# EAGLE design RGBdriverModuleAutoCurrent (EAGLE 5.07)
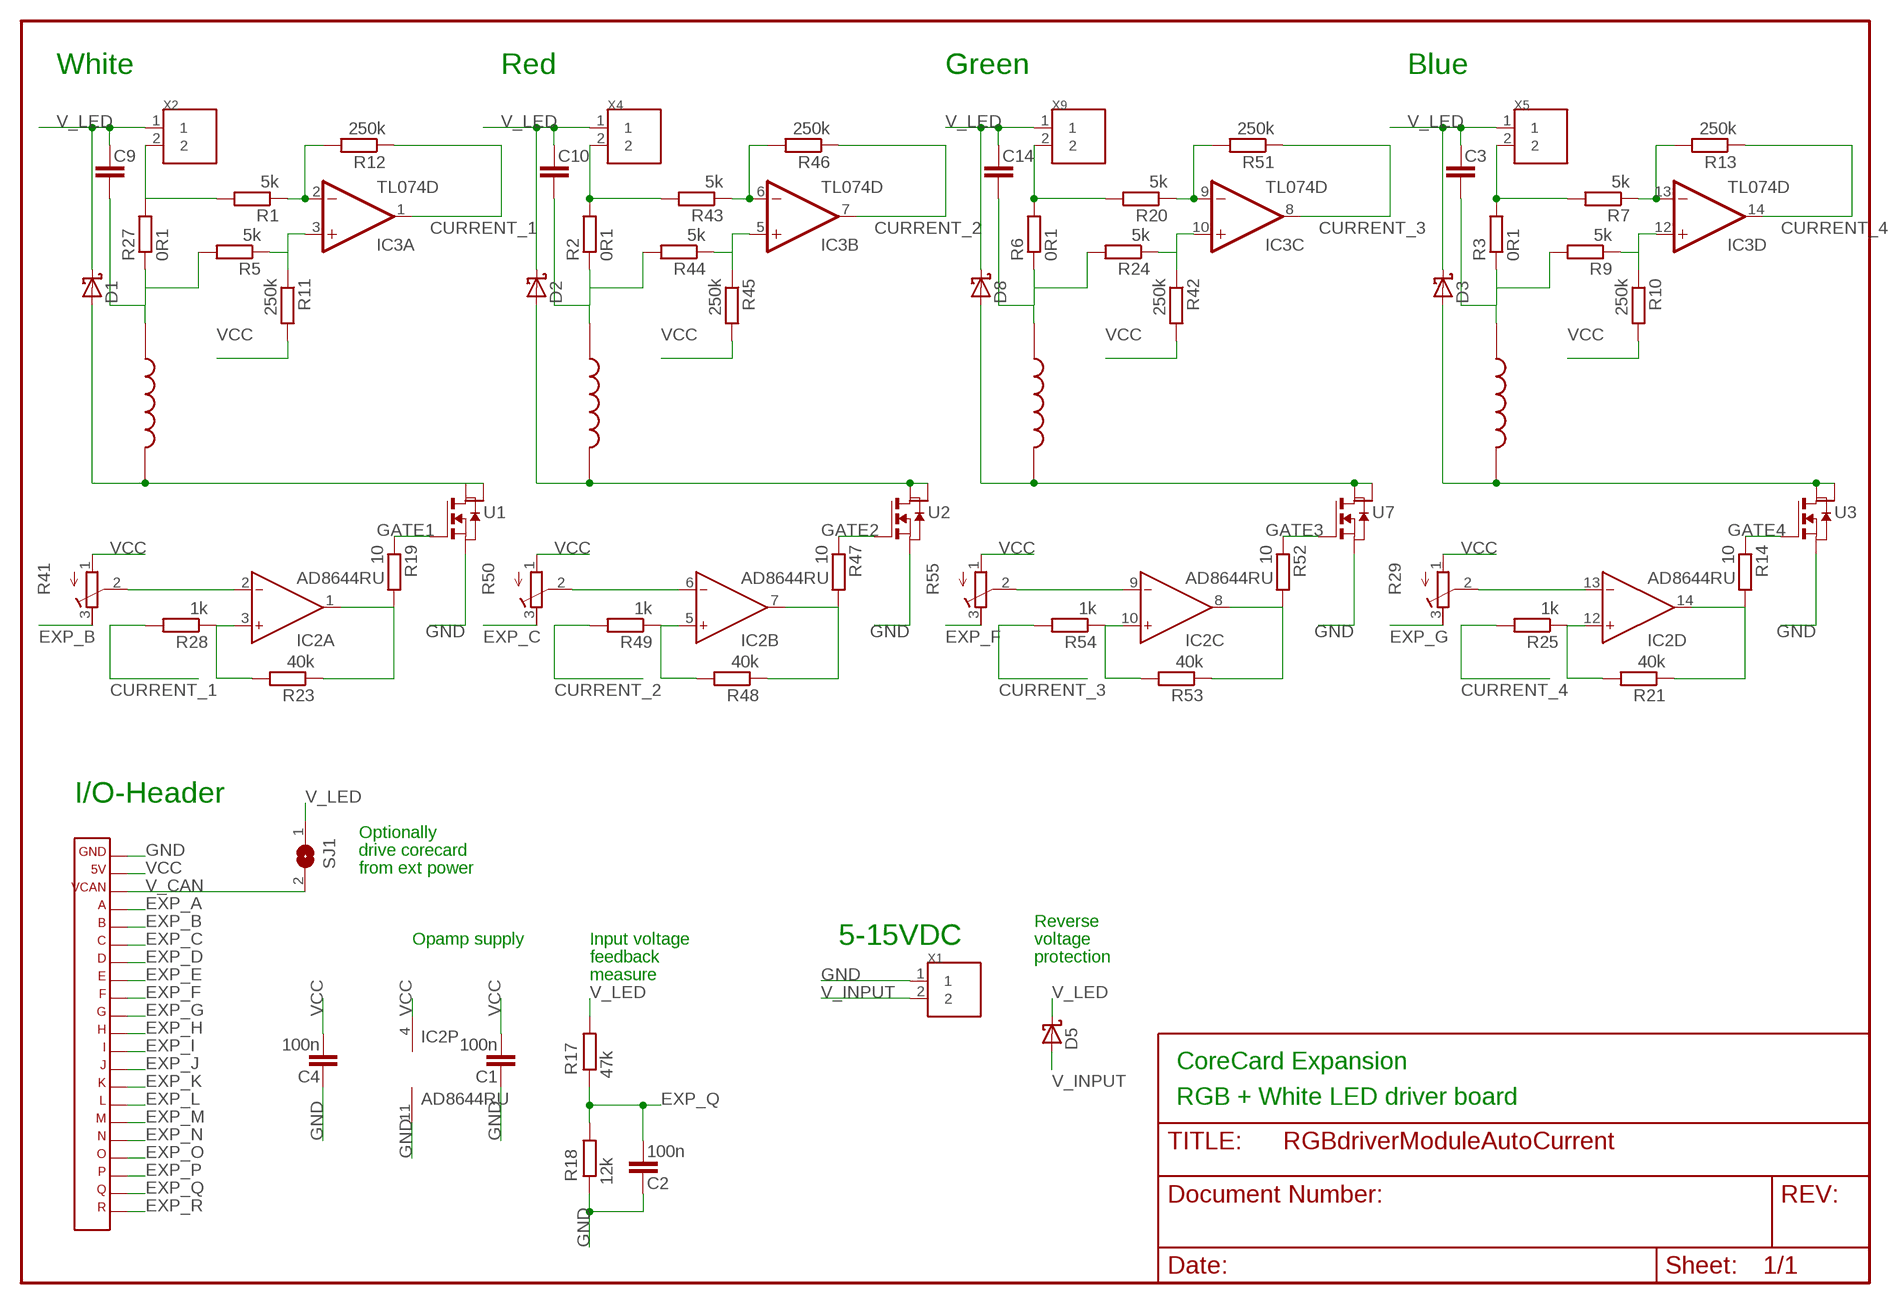
[diagram p0: schematic, sheet 1]

## Parts
C1  100n  C-EUC0603  [C0603]
C2  100n  C-EUC0603  [C0603]
C3  C-EUC1210  [C1210]
C4  100n  C-EUC0603  [C0603]
C9  C-EUC1210  [C1210]
C10  C-EUC1210  [C1210]
C14  C-EUC1210  [C1210]
D1  SCHOTTKY-DIODESMC  [SMC]
D2  SCHOTTKY-DIODESMC  [SMC]
D3  SCHOTTKY-DIODESMC  [SMC]
D5  SCHOTTKY-DIODESMC  [SMC]
D8  SCHOTTKY-DIODESMC  [SMC]
IC2  AD8644RU  [TSSOP14]
IC3  TL074D  [SO14]
L1  10X10  [10X10]
L"  10X10  [10X10]
L"1  10X10  [10X10]
L"2  10X10  [10X10]
R1  5k  R-EUR0603  [R0603]
R2  0R1  R-EUR1206  [R1206]
R3  0R1  R-EUR1206  [R1206]
R5  5k  R-EUR0603  [R0603]
R6  0R1  R-EUR1206  [R1206]
R7  5k  R-EUR0603  [R0603]
R9  5k  R-EUR0603  [R0603]
R10  250k  R-EUR0603  [R0603]
R11  250k  R-EUR0603  [R0603]
R12  250k  R-EUR0603  [R0603]
R13  250k  R-EUR0603  [R0603]
R14  10  R-EUR0603  [R0603]
R17  47k  R-EUR0603  [R0603]
R18  12k  R-EUR0603  [R0603]
R19  10  R-EUR0603  [R0603]
R20  5k  R-EUR0603  [R0603]
R21  40k  R-EUR0603  [R0603]
R23  40k  R-EUR0603  [R0603]
R24  5k  R-EUR0603  [R0603]
R25  1k  R-EUR0603  [R0603]
R27  0R1  R-EUR1206  [R1206]
R28  1k  R-EUR0603  [R0603]
R29  R-TRIM  [TRIM_PVZ3]
R41  R-TRIM  [TRIM_PVZ3]
R42  250k  R-EUR0603  [R0603]
R43  5k  R-EUR0603  [R0603]
R44  5k  R-EUR0603  [R0603]
R45  250k  R-EUR0603  [R0603]
R46  250k  R-EUR0603  [R0603]
R47  10  R-EUR0603  [R0603]
R48  40k  R-EUR0603  [R0603]
R49  1k  R-EUR0603  [R0603]
R50  R-TRIM  [TRIM_PVZ3]
R51  250k  R-EUR0603  [R0603]
R52  10  R-EUR0603  [R0603]
R53  40k  R-EUR0603  [R0603]
R54  1k  R-EUR0603  [R0603]
R55  R-TRIM  [TRIM_PVZ3]
SJ1  SJ_NO  [SJ_NO]
U1  NFT3055L175  [SOT223]
U2  NFT3055L175  [SOT223]
U3  NFT3055L175  [SOT223]
U7  NFT3055L175  [SOT223]
X1  BLOCK2  [PCB2]
X2  BLOCK2  [PCB2]
X3  CORE_IOHEADEXP  [CORE_IOHEAD_NOSILC]
X4  BLOCK2  [PCB2]
X5  BLOCK2  [PCB2]
X9  BLOCK2  [PCB2]

## Nets
CURRENT_1: IC3.1(A:OUT) R12.1 R28.2
CURRENT_2: IC3.7(B:OUT) R46.1 R49.2
CURRENT_3: IC3.8(C:OUT) R51.1 R54.2
CURRENT_4: IC3.14(D:OUT) R13.1 R25.2
EXP_A: X3.4
EXP_B: R41.3(PAD3) X3.5
EXP_C: R50.3(PAD3) X3.6
EXP_D: X3.7
EXP_E: X3.8
EXP_F: R55.3(PAD3) X3.9
EXP_G: R29.3(PAD3) X3.10
EXP_H: X3.11
EXP_I: X3.12
EXP_J: X3.13
EXP_K: X3.14
EXP_L: X3.15
EXP_M: X3.16
EXP_N: X3.17
EXP_O: X3.18
EXP_P: X3.19
EXP_Q: C2.2 R17.1 R18.2 X3.20
EXP_R: X3.21
GATE1: R19.1 U1.1(G)
GATE2: R47.1 U2.1(G)
GATE3: R52.1 U7.1(G)
GATE4: R14.1 U3.1(G)
GND: C1.1 C2.1 C4.1 IC2.11(P:V-) R18.1 U1.3(S) U2.3(S) U3.3(S) U7.3(S) X1.1 X3.1
L1: D1.A L1.P$2 U1.2(D) U1.4(D_PAD)
L2: D8.A L"2.P$2 U7.2(D) U7.4(D_PAD)
L3: D3.A L"1.P$2 U3.2(D) U3.4(D_PAD)
L8: D2.A L".P$2 U2.2(D) U2.4(D_PAD)
N$1: IC2.3(A:IN+) R23.2 R28.1
N$2: C14.2 L"2.P$1 R6.1 R24.2
N$4: R6.2 R20.2 X9.2
N$5: C9.2 L1.P$1 R5.2 R27.1
N$7: C3.2 L"1.P$1 R3.1 R9.2
N$8: R3.2 R7.2 X5.2
N$12: R1.2 R27.2 X2.2
N$13: IC3.13(D:-IN) R7.1 R13.2
N$14: IC2.14(D:OUT) R14.2 R21.1
N$15: IC2.12(D:IN+) R21.2 R25.1
N$16: IC2.1(A:OUT) R19.2 R23.1
N$17: IC2.13(D:IN-) R29.2(PAD2)
N$19: IC3.3(A:+IN) R5.1 R11.1
N$21: IC3.2(A:-IN) R1.1 R12.2
N$22: IC3.12(D:+IN) R9.1 R10.1
N$30: IC2.2(A:IN-) R41.2(PAD2)
N$31: C10.2 L".P$1 R2.1 R44.2
N$32: R2.2 R43.2 X4.2
N$33: IC3.6(B:-IN) R43.1 R46.2
N$34: IC2.7(B:OUT) R47.2 R48.1
N$35: IC2.5(B:IN+) R48.2 R49.1
N$36: IC2.6(B:IN-) R50.2(PAD2)
N$37: IC3.5(B:+IN) R44.1 R45.1
N$38: IC3.9(C:-IN) R20.1 R51.2
N$39: IC2.8(C:OUT) R52.2 R53.1
N$40: IC2.10(C:IN+) R53.2 R54.1
N$41: IC2.9(C:IN-) R55.2(PAD2)
N$42: IC3.10(C:+IN) R24.1 R42.1
V_CAN: SJ1.2 X3.3
V_INPUT: D5.A X1.2
V_LED: C3.1 C9.1 C10.1 C14.1 D1.C D2.C D3.C D5.C D8.C R17.2 SJ1.1 X2.1 X4.1 X5.1 X9.1
VCC: C1.2 C4.2 IC2.4(P:V+) R10.2 R11.2 R29.1(PAD1) R41.1(PAD1) R42.2 R45.2 R50.1(PAD1) R55.1(PAD1) X3.2

## Notes on the sheet
- White | Red | Green | Blue
- I/O-Header
- Optionally
- drive corecard
- from ext power
- Reverse
- Opamp supply | Input voltage | 5-15VDC | voltage
- feedback | protection
- measure
- CoreCard Expansion
- RGB + White LED driver board

## Power pins joined to a net without a drawn wire
V+: IC3.4(P:V+)
V-: IC3.11(P:V-)

## Library data of the parts
C1-C4 C9 C10 C14 = rcl:C-EU
D1-D3 D5 D8 = diode:SCHOTTKY-DIODE
IC2 = analog-devices:AD8644: Single and Quad 18 V Operational Amplifiers Source: http://www.analog.com/static/imported-files/data_sheets/AD8614_8644.pdf
IC3 = linear:TL074: OP AMP
L1 L" L"1 L"2 = inductor10x10:10X10
R1-R3 R5-R7 R9-R14 R17-R21 R23-R25 R27 R28 R42-R49 R51-R54 = rcl:R-EU
R29 R41 R50 R55 = rcl:R-TRIM
SJ1 = jumper:SJ_NO
U1-U3 U7 = NMOS_NTF3055L175:NFT3055L175
X1 X2 X4 X5 X9 = terminal_block:BLOCK2
X3 = expboard:CORE_IOHEAD: CoreCard IO-header for expansion cards

## Board
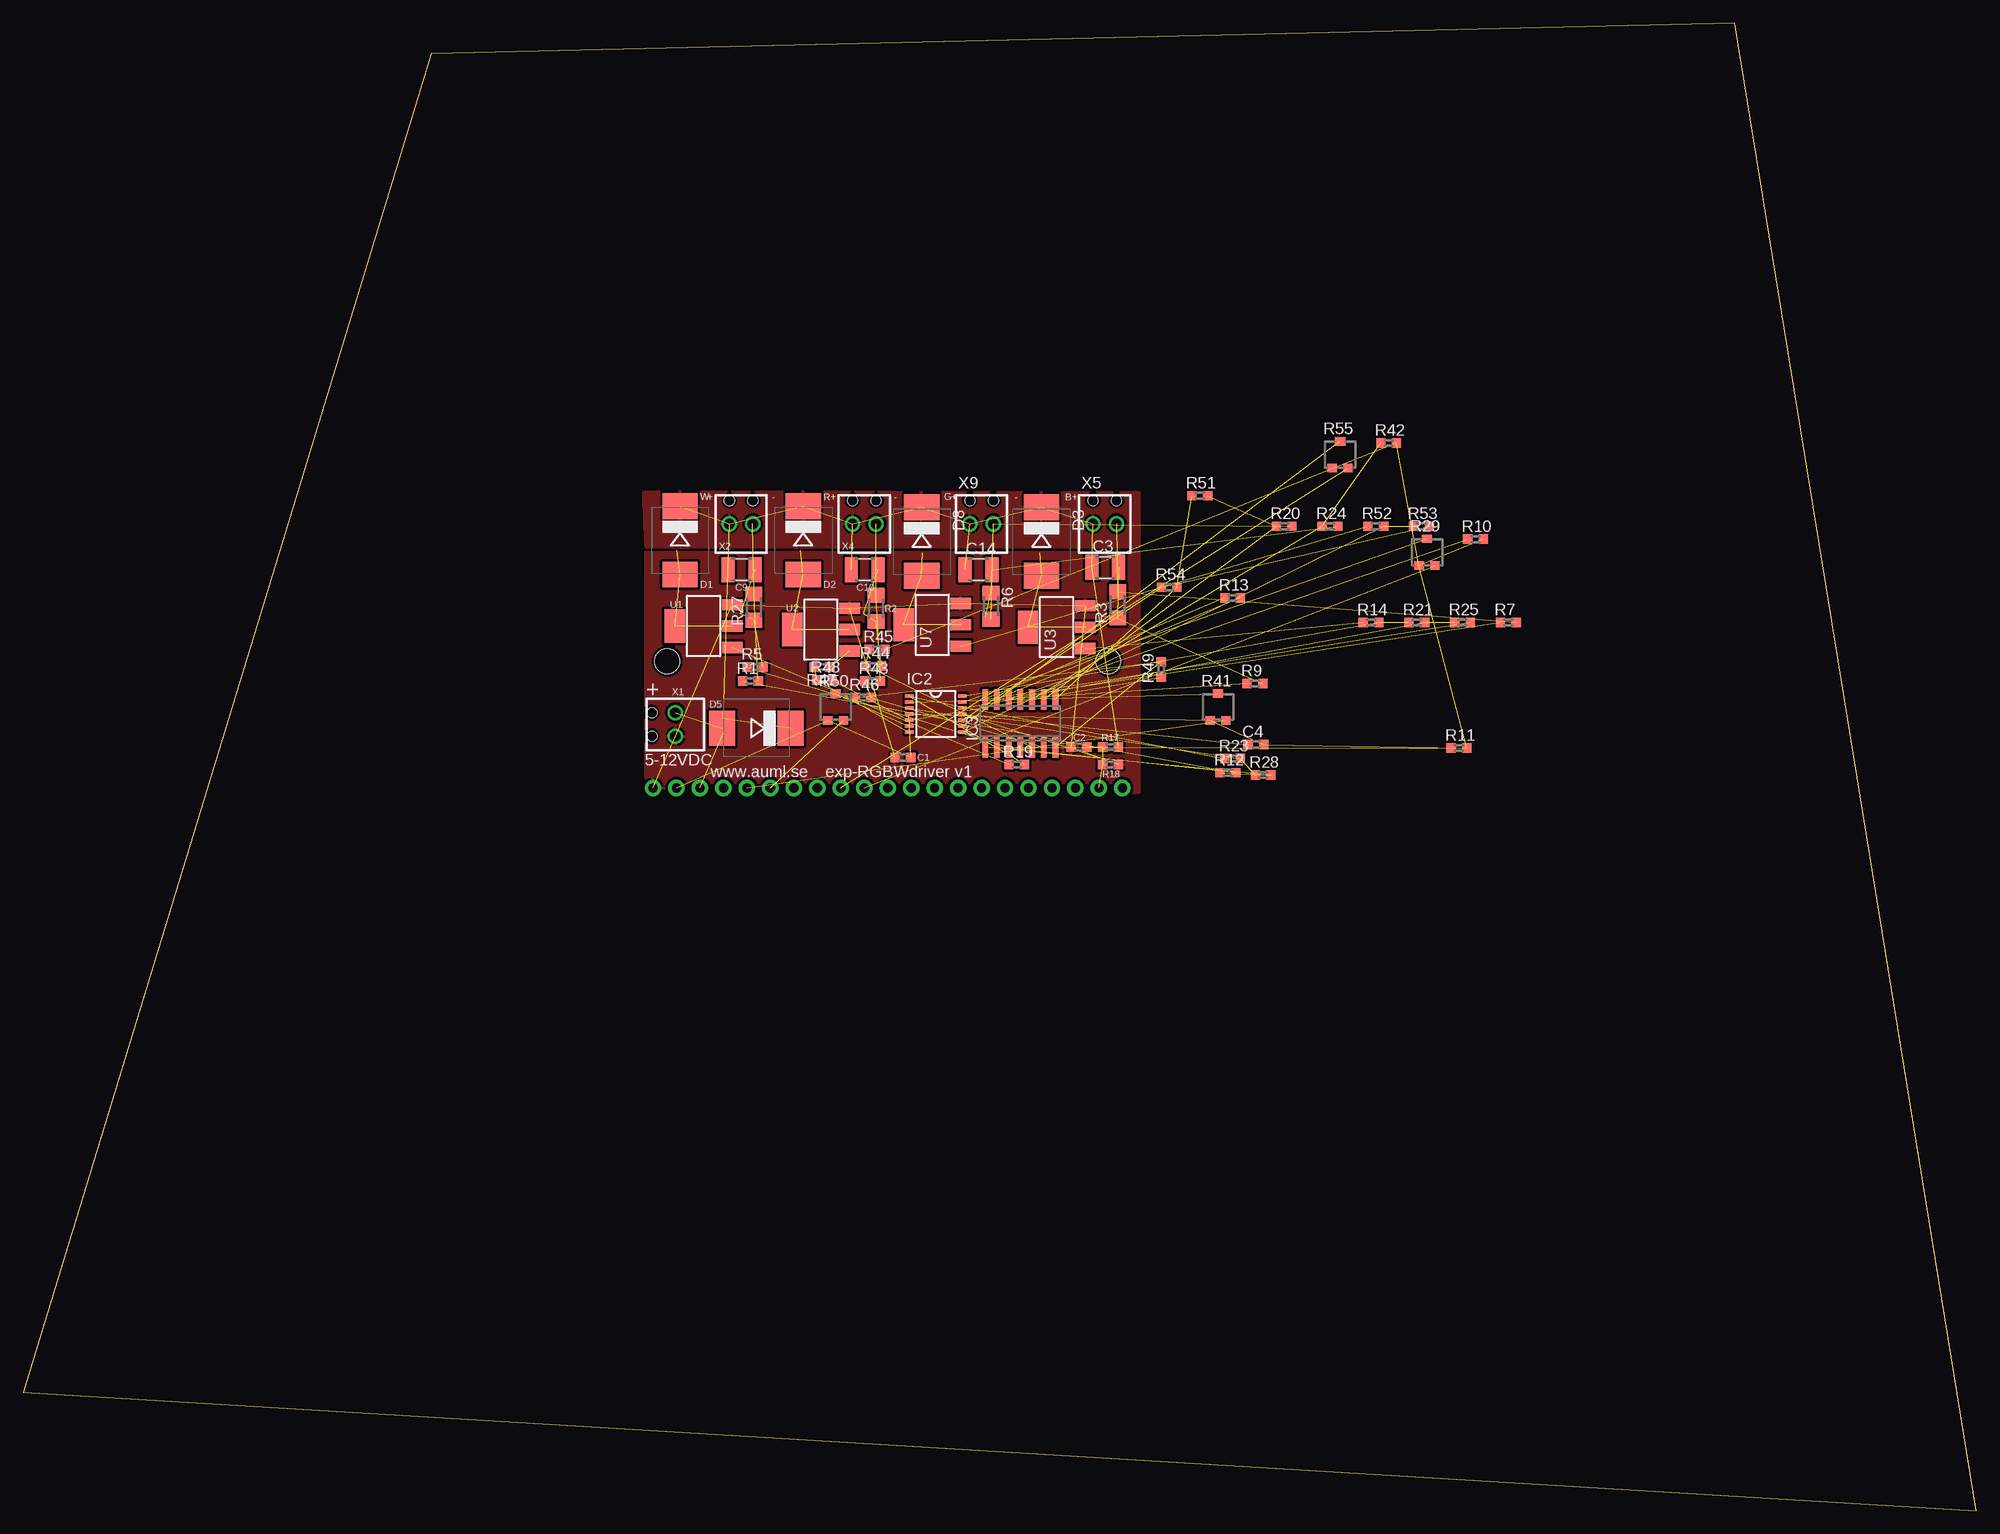
[diagram p1: board, top side]
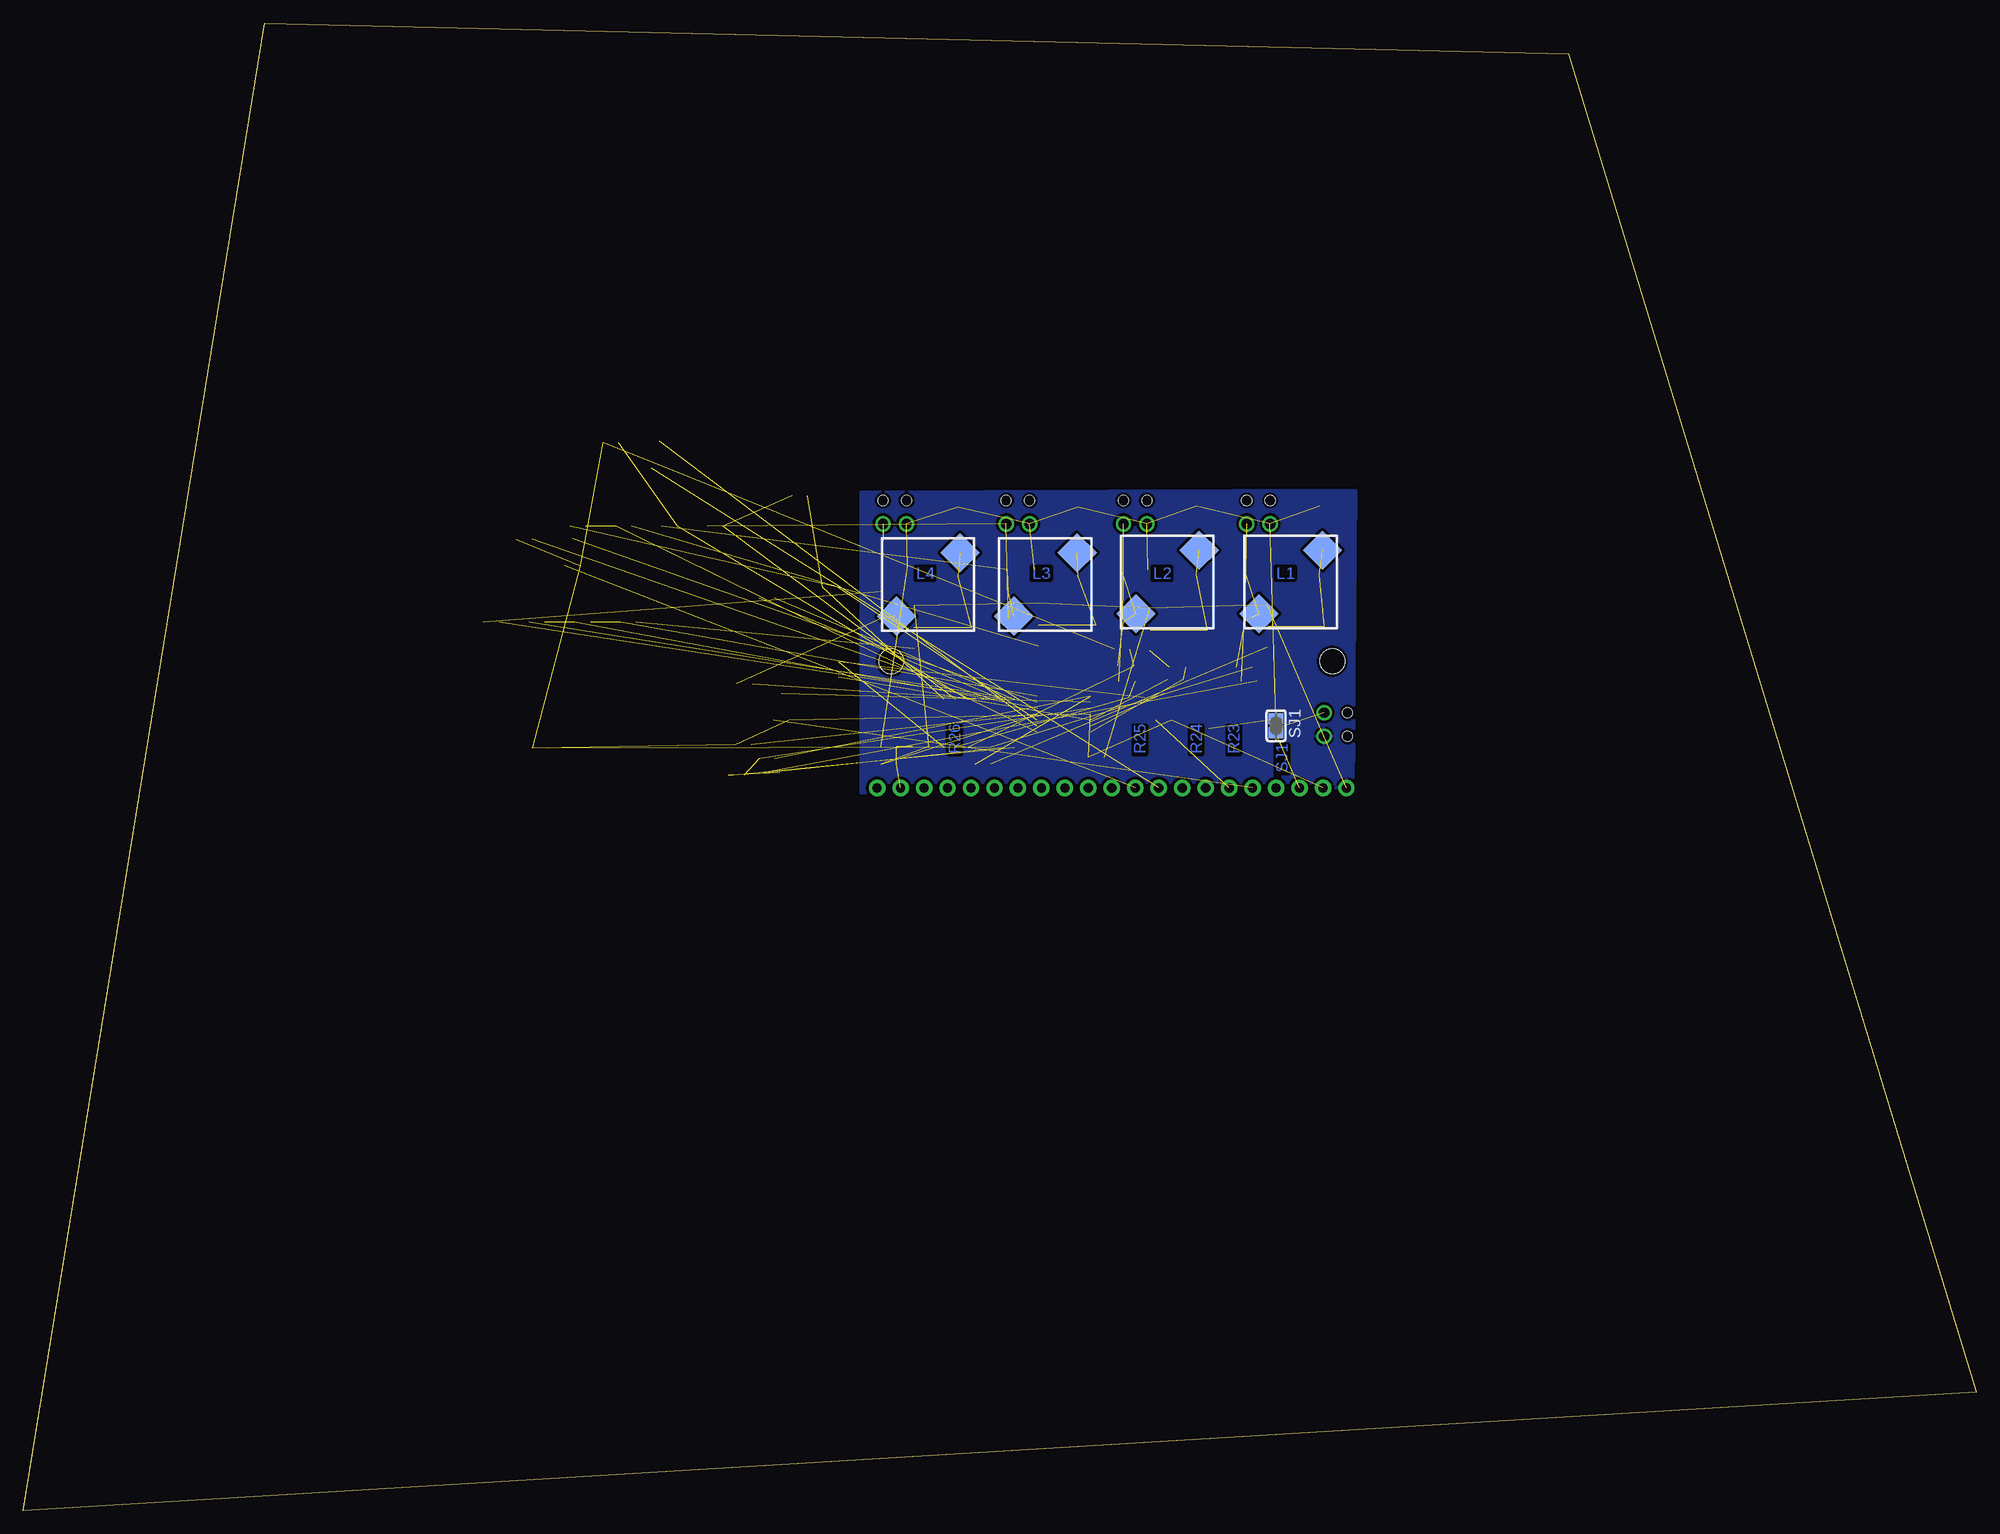
[diagram p2: board, bottom side, seen from below]

Size 211.46 x 161.01 mm. Coordinates in mm from the lower left corner, seen from the top.
Outline: 0,12.83 211.46,0 185.29,161.01 44.2,157.71 0,12.83
Copper layers (1*16): Top 0.035mm / dielectric 1.5mm / Bottom 0.035mm
Design rules "default": minimum track width 10mil, minimum drill 0.4mm, track to track 10mil, track to pad 10mil, pad to pad 10mil, via to via 10mil, smd to smd 8mil, copper to edge 10mil, drill to drill 8mil, minimum pad ring 10mil, minimum via ring 10mil, stop-mask expansion 4mil, vias tented up to drill 18mil, thermal gap 10mil
Holes 2.7 mm at 69.72,91.95 117.47,91.95

### Footprints (pad centres in the part's own frame; a part is rotated, then mirrored left to right if it is on the bottom)
C0603 = smd 1 x 1: 1 -0.85,0; 2 0.85,0
C1210 = smd 1.4 x 2.7: 1 -1.4,0; 2 1.5,0
SMC = smd 2.8 x 3.8: A 3.7,0; C -3.7,0
TSSOP14 = smd 0.9 x 0.35: 1 -2.875,1.95; 2 -2.875,1.3; 3 -2.875,0.65; 4 -2.875,0; 5 -2.875,-0.65; 6 -2.875,-1.3; 7 -2.875,-1.95; 8 2.875,-1.95; 9 2.875,-1.3; 10 2.875,-0.65; 11 2.875,0; 12 2.875,0.65; 13 2.875,1.3; 14 2.875,1.95
SO14 = smd 0.6 x 2.2: 1 -3.81,-2.6; 2 -2.54,-2.6; 3 -1.27,-2.6; 4 0,-2.6; 5 1.27,-2.6; 6 2.54,-2.6; 7 3.81,-2.6; 8 3.81,2.6; 9 2.54,2.6; 10 1.27,2.6; 11 0,2.6; 12 -1.27,2.6; 13 -2.54,2.6; 14 -3.81,2.6
10X10 = smd 3 x 3 rotated 45: P$1 1.588,1.588; P$2 8.447,8.447
R0603 = smd 0.991 x 1.016: 1 -0.85,0; 2 0.85,0
R1206 = smd 1.6 x 1.803: 1 -1.422,0; 2 1.422,0
TRIM_PVZ3 = smd 1 x 0.9: 1 0.5,0.45; 3 2.2,0.45 | smd 1.1 x 0.9: 2 1.35,3.35
SJ_NO = smd 1.168 x 1.6: 1 -0.762,0; 2 0.762,0
SOT223 = smd 1.219 x 2.235: 1 -2.311,-3.099; 2 0,-3.099; 3 2.311,-3.099 | smd 3.6 x 2.2: 4 0,3.099
PCB2 = drill 1.1 round: 1 -2.54,0; 2 0,0 | hole 1.1: -2.54,2.54; 0,2.54
CORE_IOHEAD_NOSILC = drill 1 pad 1.778 round: 1 25.4,0; 2 22.86,0; 3 20.32,0; 4 17.78,0; 5 15.24,0; 6 12.7,0; 7 10.16,0; 8 7.62,0; 9 5.08,0; 10 2.54,0; 11 0,0; 12 -2.54,0; 13 -5.08,0; 14 -7.62,0; 15 -10.16,0; 16 -12.7,0; 17 -15.24,0; 18 -17.78,0; 19 -20.32,0; 20 -22.86,0; 21 -25.4,0

### Placement (x,y rotation side)
C1  95.25,81.53 0 top
C2  114.3,82.68 0 top
C3  117.09,102.11 0 top
C4  133.48,82.93 0 top
C9  77.72,101.85 0 top
C10  91.06,101.85 0 top
C14  103.38,101.85 0 top
D1  71.12,105.03 270 top
D2  84.45,105.03 270 top
D3  110.24,104.9 270 top
D5  79.38,84.71 180 top
D8  97.28,104.9 270 top
IC2  98.81,86.23 0 top
IC3  107.95,85.22 0 top
L1  79.25,95.5 0 bottom
L"  92.58,95.5 0 bottom
L"1  118.49,95.25 0 bottom
L"2  105.79,95.25 0 bottom
R1  78.74,89.79 0 top
R2  92.33,97.66 90 top
R3  118.49,98.04 90 top
R5  79.25,91.31 0 top
R6  104.78,97.92 270 top
R7  160.78,96.14 0 top
R9  133.35,89.53 0 top
R10  157.23,105.16 0 top
R11  155.45,82.55 0 top
R12  130.43,79.88 0 top
R13  130.94,98.81 0 top
R14  145.92,96.14 0 top
R17  117.73,82.68 0 top
R18  117.73,80.77 180 top
R19  107.57,80.77 0 top
R20  136.53,106.55 0 top
R21  150.88,96.14 0 top
R23  130.94,81.41 0 top
R24  141.48,106.55 0 top
R25  155.83,96.14 0 top
R27  79.12,97.79 90 top
R28  134.24,79.63 0 top
R29  150.62,101.85 0 top
R41  128.02,85.09 0 top
R42  147.83,115.57 0 top
R43  91.95,89.79 0 top
R44  92.08,91.44 0 top
R45  92.46,93.22 0 top
R46  90.93,88.01 0 top
R47  86.49,91.31 180 top
R48  86.74,89.92 0 top
R49  123.19,91.06 90 top
R50  86.61,85.09 0 top
R51  127.38,109.86 0 top
R52  146.43,106.55 0 top
R53  151.38,106.55 0 top
R54  124.08,99.95 0 top
R55  141.22,112.4 0 top
SJ1  75.82,84.96 270 bottom
U1  73.66,95.76 90 top
U2  86.36,95.38 90 top
U3  111.89,95.63 90 top
U7  98.42,95.89 90 top
X1  70.61,86.36 90 top
X2  78.99,106.81 0 top
X3  93.6,78.23 0 bottom
X4  92.33,106.81 0 top
X5  118.36,106.81 0 top
X9  105.03,106.81 0 top

### Tracks (layer width: path | path; a pad name or v marks a point on that pad's centre or on a via)
CURRENT_1  (2 unrouted)
CURRENT_2  (2 unrouted)
CURRENT_3  (2 unrouted)
CURRENT_4  (2 unrouted)
EXP_B  (1 unrouted)
EXP_C  (1 unrouted)
EXP_F  (1 unrouted)
EXP_G  (1 unrouted)
EXP_Q  (3 unrouted)
GATE1  (1 unrouted)
GATE2  (1 unrouted)
GATE3  (1 unrouted)
GATE4  (1 unrouted)
GND  (10 unrouted)
  pour Bottom (isolate 0.305, rank 3): 67.18,110.46 120.78,110.21 120.78,77.72 67.44,77.72
  pour Top (isolate 0.305, rank 3): 67.44,103.86 120.78,103.99 120.78,77.72 67.44,77.72
L1  (3 unrouted)
L2  (3 unrouted)
L3  (3 unrouted)
L8  (3 unrouted)
N$1  (2 unrouted)
N$2  (3 unrouted)
N$4  (2 unrouted)
N$5  (3 unrouted)
N$7  (3 unrouted)
N$8  (2 unrouted)
N$12  (2 unrouted)
N$13  (2 unrouted)
N$14  (2 unrouted)
N$15  (2 unrouted)
N$16  (2 unrouted)
N$17  (1 unrouted)
N$19  (2 unrouted)
N$21  (2 unrouted)
N$22  (2 unrouted)
N$30  (1 unrouted)
N$31  (3 unrouted)
N$32  (2 unrouted)
N$33  (2 unrouted)
N$34  (2 unrouted)
N$35  (2 unrouted)
N$36  (1 unrouted)
N$37  (2 unrouted)
N$38  (2 unrouted)
N$39  (2 unrouted)
N$40  (2 unrouted)
N$41  (1 unrouted)
N$42  (2 unrouted)
V_CAN  (1 unrouted)
V_INPUT  (1 unrouted)
V_LED  (14 unrouted)
  pour Top (isolate 0.305): 67.18,110.34 120.78,110.21 120.78,104.29 67.44,104.29
VCC  (11 unrouted)

### Text on the board
Bottom: L1 | L2 | L3 | L4 | R23 | R24 | R25 | R26 | SJ1
tPlace: W | + | - | R | + | - | G | + | - | B | + | + | 5-12VDC | www.auml.se | exp-RGBWdriver v1
Document: Corecard edge | Top is component side | Expansion will be mounted bottom to bottom with CoreCard | Change vertical dimension to fit | Remove I/O-header silcscreen if neccesary | Remove mounting holes if neccesary
tDocu: A | B | C | D | E | F | G | H | I | J | K | L | M | N | O | P | Q | R